# EAGLE design i2c-7segled-SOIC (EAGLE 7.3.0)
CNAME: aaa
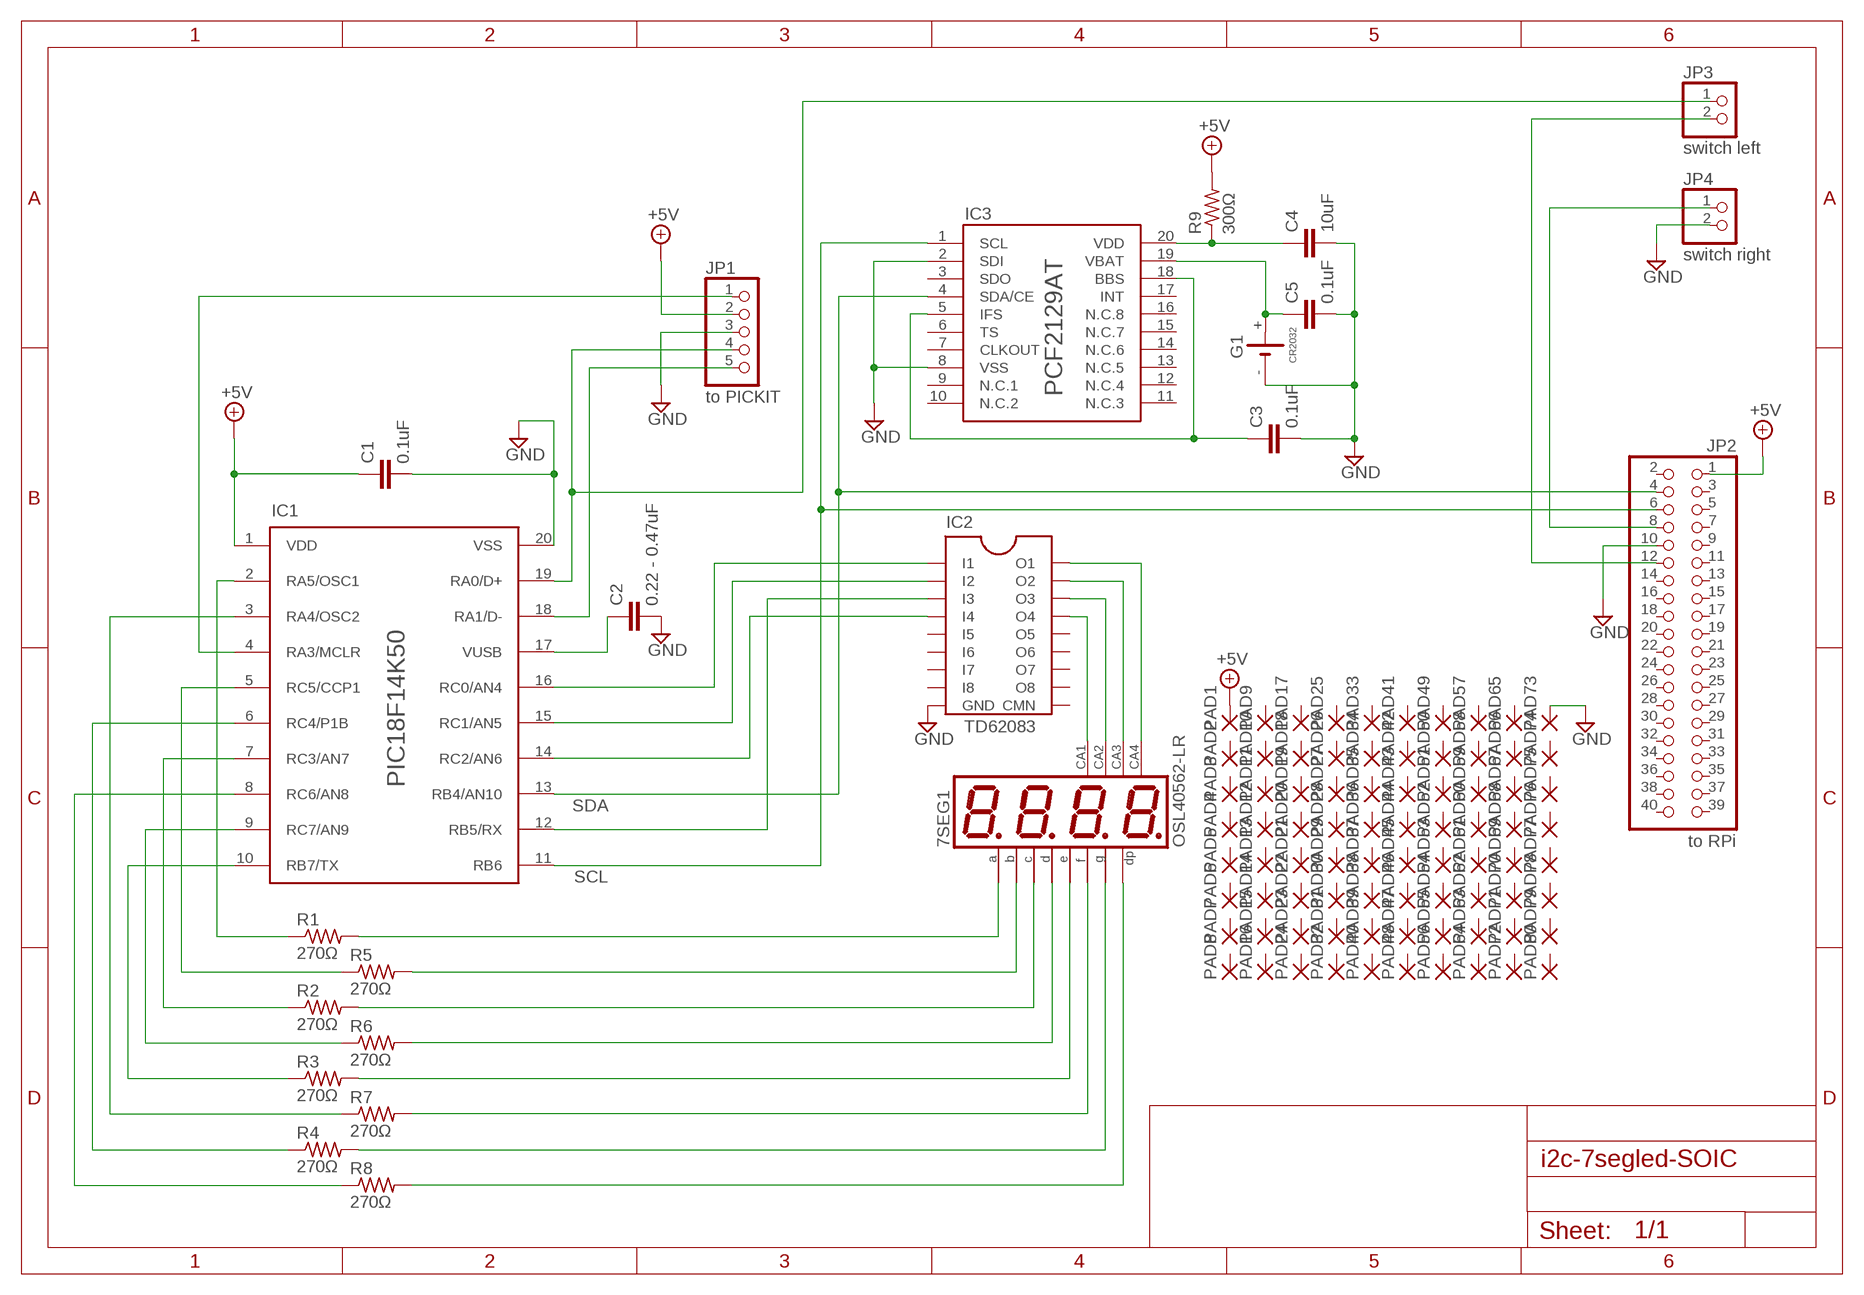
[diagram p0: schematic, sheet 1]

## Parts
7SEG1  OSL40562-LR  OSL40562-IR  [OSL40562]
C1  0.1uF  C-EUC0504  [C0504]
C2  0.22 - 0.47uF  C-EUC0504  [C0504]
C3  0.1uF  C-EUC0504  [C0504]
C4  10uF  C-EUC0504  [C0504]
C5  0.1uF  C-EUC0504  [C0504]
G1  CR2032  HU2032  [HU2032]
IC1  PIC18F14K50  PIC18F14K50-SO  [SO20]
IC2  TD62083  [SO18]
IC3  PCF2129AT  [SO20]
JP1  to PICKIT  PINHD-1X5  [1X05]
JP2  to RPi  PINHD-2X20  [2X20]
JP3  switch left  PINHD-1X2  [1X02]
JP4  switch right  PINHD-1X2  [1X02]
PAD1  1,6/0,9  [1,6/0,9]
PAD2  1,6/0,9  [1,6/0,9]
PAD3  1,6/0,9  [1,6/0,9]
PAD4  1,6/0,9  [1,6/0,9]
PAD5  1,6/0,9  [1,6/0,9]
PAD6  1,6/0,9  [1,6/0,9]
PAD7  1,6/0,9  [1,6/0,9]
PAD8  1,6/0,9  [1,6/0,9]
PAD9  1,6/0,9  [1,6/0,9]
PAD10  1,6/0,9  [1,6/0,9]
PAD11  1,6/0,9  [1,6/0,9]
PAD12  1,6/0,9  [1,6/0,9]
PAD13  1,6/0,9  [1,6/0,9]
PAD14  1,6/0,9  [1,6/0,9]
PAD15  1,6/0,9  [1,6/0,9]
PAD16  1,6/0,9  [1,6/0,9]
PAD17  1,6/0,9  [1,6/0,9]
PAD18  1,6/0,9  [1,6/0,9]
PAD19  1,6/0,9  [1,6/0,9]
PAD20  1,6/0,9  [1,6/0,9]
PAD21  1,6/0,9  [1,6/0,9]
PAD22  1,6/0,9  [1,6/0,9]
PAD23  1,6/0,9  [1,6/0,9]
PAD24  1,6/0,9  [1,6/0,9]
PAD25  1,6/0,9  [1,6/0,9]
PAD26  1,6/0,9  [1,6/0,9]
PAD27  1,6/0,9  [1,6/0,9]
PAD28  1,6/0,9  [1,6/0,9]
PAD29  1,6/0,9  [1,6/0,9]
PAD30  1,6/0,9  [1,6/0,9]
PAD31  1,6/0,9  [1,6/0,9]
PAD32  1,6/0,9  [1,6/0,9]
PAD33  1,6/0,9  [1,6/0,9]
PAD34  1,6/0,9  [1,6/0,9]
PAD35  1,6/0,9  [1,6/0,9]
PAD36  1,6/0,9  [1,6/0,9]
PAD37  1,6/0,9  [1,6/0,9]
PAD38  1,6/0,9  [1,6/0,9]
PAD39  1,6/0,9  [1,6/0,9]
PAD40  1,6/0,9  [1,6/0,9]
PAD41  1,6/0,9  [1,6/0,9]
PAD42  1,6/0,9  [1,6/0,9]
PAD43  1,6/0,9  [1,6/0,9]
PAD44  1,6/0,9  [1,6/0,9]
PAD45  1,6/0,9  [1,6/0,9]
PAD46  1,6/0,9  [1,6/0,9]
PAD47  1,6/0,9  [1,6/0,9]
PAD48  1,6/0,9  [1,6/0,9]
PAD49  1,6/0,9  [1,6/0,9]
PAD50  1,6/0,9  [1,6/0,9]
PAD51  1,6/0,9  [1,6/0,9]
PAD52  1,6/0,9  [1,6/0,9]
PAD53  1,6/0,9  [1,6/0,9]
PAD54  1,6/0,9  [1,6/0,9]
PAD55  1,6/0,9  [1,6/0,9]
PAD56  1,6/0,9  [1,6/0,9]
PAD57  1,6/0,9  [1,6/0,9]
PAD58  1,6/0,9  [1,6/0,9]
PAD59  1,6/0,9  [1,6/0,9]
PAD60  1,6/0,9  [1,6/0,9]
PAD61  1,6/0,9  [1,6/0,9]
PAD62  1,6/0,9  [1,6/0,9]
PAD63  1,6/0,9  [1,6/0,9]
PAD64  1,6/0,9  [1,6/0,9]
PAD65  1,6/0,9  [1,6/0,9]
PAD66  1,6/0,9  [1,6/0,9]
PAD67  1,6/0,9  [1,6/0,9]
PAD68  1,6/0,9  [1,6/0,9]
PAD69  1,6/0,9  [1,6/0,9]
PAD70  1,6/0,9  [1,6/0,9]
PAD71  1,6/0,9  [1,6/0,9]
PAD72  1,6/0,9  [1,6/0,9]
PAD73  1,6/0,9  [1,6/0,9]
PAD74  1,6/0,9  [1,6/0,9]
PAD75  1,6/0,9  [1,6/0,9]
PAD76  1,6/0,9  [1,6/0,9]
PAD77  1,6/0,9  [1,6/0,9]
PAD78  1,6/0,9  [1,6/0,9]
PAD79  1,6/0,9  [1,6/0,9]
PAD80  1,6/0,9  [1,6/0,9]
R1  270Ω  R-US_M0805  [M0805]
R2  270Ω  R-US_M0805  [M0805]
R3  270Ω  R-US_M0805  [M0805]
R4  270Ω  R-US_M0805  [M0805]
R5  270Ω  R-US_M0805  [M0805]
R6  270Ω  R-US_M0805  [M0805]
R7  270Ω  R-US_M0805  [M0805]
R8  270Ω  R-US_M0805  [M0805]
R9  300Ω  R-US_M0805  [M0805]

## Nets
+5V [power]: C1.1 IC1.1(VDD) JP1.2 JP2.1 PAD1.1(P) R9.2
GND [power]: C1.2 C2.2 C3.2 C4.2 C5.2 G1.- IC1.20(VSS) IC2.9(GND) IC3.2(SDI) IC3.8(VSS) JP1.3 JP2.10 JP4.2 PAD73.1(P)
N$1: 7SEG1.6(CA) IC2.18(O1)
N$2: C3.1 IC3.5(IFS) IC3.18(BBS)
N$3: C2.1 IC1.17(VUSB)
N$4: IC1.12(RB5/RX) IC2.3(I3)
N$5: JP2.12 JP3.2
N$7: IC1.14(RC2/AN6) IC2.4(I4)
N$8: IC1.15(RC1/AN5) IC2.2(I2)
N$9: IC1.16(RC0/AN4) IC2.1(I1)
N$10 [power]: C5.1 G1.+ IC3.19(VBAT)
N$11: 7SEG1.9(CA) IC2.16(O3)
N$12: 7SEG1.8(CA) IC2.17(O2)
N$13: 7SEG1.12(CA) IC2.15(O4)
N$14: IC1.2(RA5/OSC1) R1.1
N$15: 7SEG1.11(A) R1.2
N$16: IC1.5(RC5/CCP1) R5.1
N$17: IC1.7(RC3/AN7) R2.1
N$18: IC1.9(RC7/AN9) R6.1
N$19: IC1.10(RB7/TX) R3.1
N$20: IC1.3(RA4/OSC2) R7.1
N$21: IC1.6(RC4/P1B) R4.1
N$22: IC1.8(RC6/AN8) R8.1
N$23: 7SEG1.7(B) R5.2
N$24: 7SEG1.4(C) R2.2
N$25: 7SEG1.2(D) R6.2
N$26: 7SEG1.1(E) R3.2
N$27: 7SEG1.10(F) R7.2
N$28: 7SEG1.5(G) R4.2
N$29: 7SEG1.3(DP) R8.2
N$30: IC1.4(RA3/MCLR) JP1.1
N$31: IC1.19(RA0/D+) JP1.4 JP3.1
N$32: IC1.18(RA1/D-) JP1.5
N$35: IC1.11(RB6) IC3.1(SCL) JP2.6
N$36: JP2.8 JP4.1
N$39 [power]: C4.1 IC3.20(VDD) R9.1
SCL: IC1.13(RB4/AN10) IC3.4(SDA/CE) JP2.4
Unconnected: G1.+@2(+) IC2.5(I5) IC2.6(I6) IC2.7(I7) IC2.8(I8) IC2.10(CMN) IC2.11(O8) IC2.12(O7) IC2.13(O6) IC2.14(O5) IC3.3(SDO) IC3.6(TS) IC3.7(CLKOUT) IC3.9(N.C.1) IC3.10(N.C.2) IC3.11(N.C.3) IC3.12(N.C.4) IC3.13(N.C.5) IC3.14(N.C.6) IC3.15(N.C.7) IC3.16(N.C.8) IC3.17(INT) JP2.2 JP2.3 JP2.5 JP2.7 JP2.9 JP2.11 JP2.13 JP2.14 JP2.15 JP2.16 JP2.17 JP2.18 JP2.19 JP2.20 JP2.21 JP2.22 JP2.23 JP2.24 JP2.25 JP2.26 JP2.27 JP2.28 JP2.29 JP2.30 JP2.31 JP2.32 JP2.33 JP2.34 JP2.35 JP2.36 JP2.37 JP2.38 JP2.39 JP2.40 PAD2.1(P) PAD3.1(P) PAD4.1(P) PAD5.1(P) PAD6.1(P) PAD7.1(P) PAD8.1(P) PAD9.1(P) PAD10.1(P) PAD11.1(P) PAD12.1(P) PAD13.1(P) PAD14.1(P) PAD15.1(P) PAD16.1(P) PAD17.1(P) PAD18.1(P) PAD19.1(P) PAD20.1(P) PAD21.1(P) PAD22.1(P) PAD23.1(P) PAD24.1(P) PAD25.1(P) PAD26.1(P) PAD27.1(P) PAD28.1(P) PAD29.1(P) PAD30.1(P) PAD31.1(P) PAD32.1(P) PAD33.1(P) PAD34.1(P) PAD35.1(P) PAD36.1(P) PAD37.1(P) PAD38.1(P) PAD39.1(P) PAD40.1(P) PAD41.1(P) PAD42.1(P) PAD43.1(P) PAD44.1(P) PAD45.1(P) PAD46.1(P) PAD47.1(P) PAD48.1(P) PAD49.1(P) PAD50.1(P) PAD51.1(P) PAD52.1(P) PAD53.1(P) PAD54.1(P) PAD55.1(P) PAD56.1(P) PAD57.1(P) PAD58.1(P) PAD59.1(P) PAD60.1(P) PAD61.1(P) PAD62.1(P) PAD63.1(P) PAD64.1(P) PAD65.1(P) PAD66.1(P) PAD67.1(P) PAD68.1(P) PAD69.1(P) PAD70.1(P) PAD71.1(P) PAD72.1(P) PAD74.1(P) PAD75.1(P) PAD76.1(P) PAD77.1(P) PAD78.1(P) PAD79.1(P) PAD80.1(P)

## Notes on the sheet
- SDA

## Library data of the parts
7SEG1 = display-kingbright_2:OSL40562-?*: 14.22mm (0.56INCH) FOUR DIGIT NUMERIC DISPLAY OSL40562-xx(http://www.optosupply.com/UploadFile/PDF/osl40562-xx.pdf); COLOR: Red; MCD: 20mcd; MN: 630mn; VF: 2.1V
C1-C5 = rcl:C-EU: CAPACITOR, European symbol
G1 = takachi-battery-holder:HU2032: TAKACHI - Battery Holder - HU2032
IC1 = pic18f14k50:PIC18F14K50-SO: 20-Lead Plastic Shrink Small Outline (SO) - Wide, 7.50mm Body [SOIC] Source: http://ww1.microchip.com/downloads/en/DeviceDoc/40001350F.pdf Souce: http://ww1.microchip.com/downloads/jp/DeviceDoc/41350D_JP.pdf (Japanese)
IC2 = toshiba-td62083:TD62083: 8ch Darlington Sink Driver Source: http://akizukidenshi.com/download/TD62083AP.pdf
IC3 = nxp_pcf212X:PCF2129AT: Accurate RTC with integrated quartz crystal for industrial applications
JP1 = pinhead:PINHD-1X5: PIN HEADER
JP2 = pinhead:PINHD-2X20: PIN HEADER
JP3 JP4 = pinhead:PINHD-1X2: PIN HEADER
PAD1-PAD80 = testpad:1,6/0,9: THROUGH-HOLE PAD
R1-R9 = rcl:R-US_: RESISTOR, American symbol

## Net classes
0 default: width 0.254 mm, drill 0.305 mm, clearance 0.254 mm
1 analog: width 0.406 mm, drill 0.305 mm, clearance 0.406 mm
2 power: width 0.61 mm, drill 0.305 mm, clearance 0.254 mm

## Board
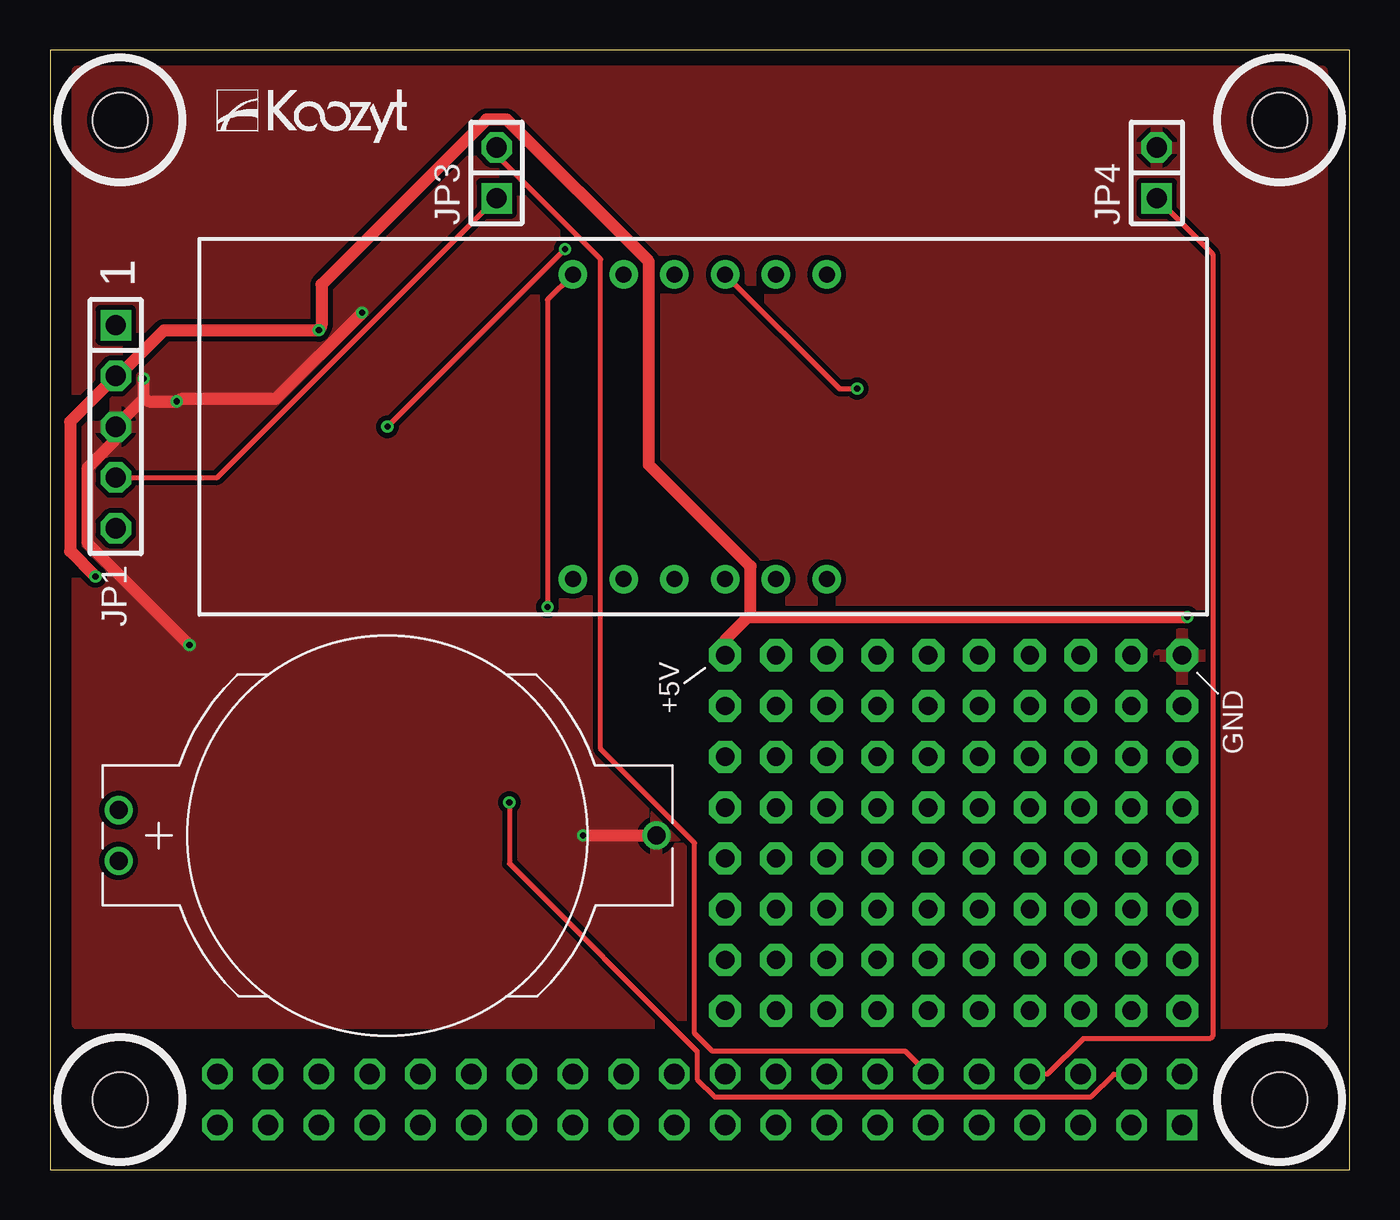
[diagram p1: board, top side]
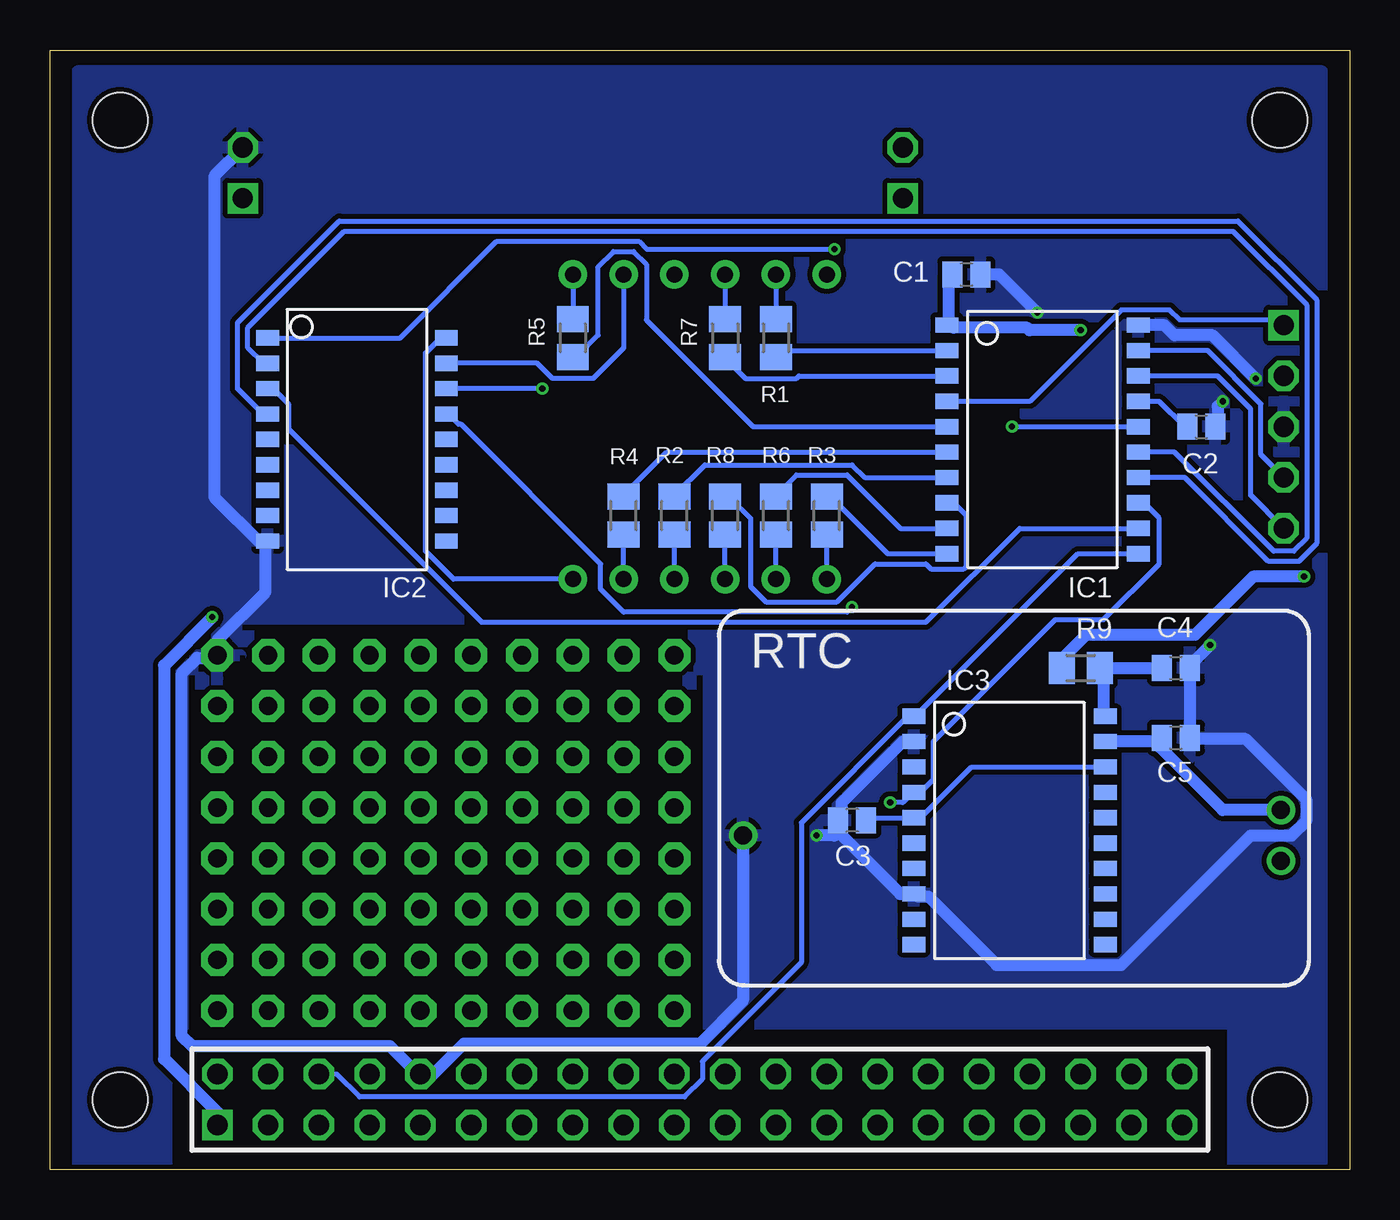
[diagram p2: board, bottom side, seen from below]

Size 65 x 56 mm. Coordinates in mm from the lower left corner, seen from the top.
Outline: 0,56 0,0 65,0 65,56 0,56
Copper layers (1*16): Top 0.035mm / dielectric 1.5mm / Bottom 0.035mm
Design rules "Elecrow_2-layer_eagle_rule": minimum track width 6mil, minimum drill 12mil, track to track 6mil, track to pad 6mil, pad to pad 6mil, via to via 6mil, smd to smd 0mil, copper to edge 10mil, drill to drill 10mil, minimum pad ring 10mil, minimum via ring 6mil, stop-mask expansion 2mil, vias tented up to drill 100mil, thermal gap 10mil
Holes 2.75 mm at 61.5,3.5 61.5,52.5 3.5,52.5 3.5,3.5
tRestrict: area 34.9,7.9 to 35.2,25.7; area 37.5,7.9 to 37.7,25.7; area 40,7.9 to 40.2,25.7; area 42.5,7.9 to 42.8,25.7; area 45.1,7.9 to 45.3,25.7; area 47.6,7.9 to 47.9,25.7; area 50.2,7.9 to 50.4,25.7; area 52.7,7.9 to 52.9,25.7; area 55.2,7.9 to 55.5,25.7; area 55.2,7.9 to 55.5,25.7; area 57.8,6.9 to 58,24.7; area 35,27 to 55.4,27.2; 2 more areas
bRestrict: area 55.2,7.9 to 55.5,25.7; area 52.7,7.9 to 52.9,25.7; area 50.2,7.9 to 50.4,25.7; area 47.6,7.9 to 47.9,25.7; area 45.1,7.9 to 45.3,25.7; area 42.5,7.9 to 42.8,25.7; area 40,7.9 to 40.2,25.7; area 37.5,7.9 to 37.7,25.7; area 34.9,7.9 to 35.2,25.7; area 57.8,6.9 to 58,24.7; area 32.4,6.9 to 32.6,24.7; area 35,27 to 55.4,27.2; 1 more areas

### Footprints (pad centres in the part's own frame; a part is rotated, then mirrored left to right if it is on the bottom)
OSL40562 = drill 0.8 pad 1.422: 1 -6.35,-7.62; 2 -3.81,-7.62; 3 -1.27,-7.62; 4 1.27,-7.62; 5 3.81,-7.62; 6 6.35,-7.62; 7 6.35,7.62; 8 3.81,7.62; 9 1.27,7.62; 10 -1.27,7.62; 11 -3.81,7.62; 12 -6.35,7.62
C0504 = smd 1 x 1.3: 1 -0.7,0; 2 0.7,0
HU2032 = drill 0.9: + -13.45,1.27; +@2 -13.45,-1.27; - 13.45,0
SO20 = smd 0.762 x 1.143: 1 -5.08,-4.788; 2 -3.81,-4.788; 3 -2.54,-4.788; 4 -1.27,-4.788; 5 0,-4.788; 6 1.27,-4.788; 7 2.54,-4.788; 8 3.81,-4.788; 9 5.08,-4.788; 10 6.35,-4.788; 11 6.35,4.788; 12 5.08,4.788; 13 3.81,4.788; 14 2.54,4.788; 15 1.27,4.788; 16 0,4.788; 17 -1.27,4.788; 18 -2.54,4.788; 19 -3.81,4.788; 20 -5.08,4.788
SO18 = smd 0.762 x 1.143: 1 -5.08,-3.835; 2 -3.81,-3.835; 3 -2.54,-3.835; 4 -1.27,-3.835; 5 0,-3.835; 6 1.27,-3.835; 7 2.54,-3.835; 8 3.81,-3.835; 9 5.08,-3.835; 10 5.08,5.105; 11 3.81,5.105; 12 2.54,5.105; 13 1.27,5.105; 14 0,5.105; 15 -1.27,5.105; 16 -2.54,5.105; 17 -3.81,5.105; 18 -5.08,5.105
1X05 = drill 1.016 square: 1 -5.08,0 | drill 1.016 octagon: 2 -2.54,0; 3 0,0; 4 2.54,0; 5 5.08,0
2X20 = drill 1.016 square: 1 -24.13,-1.27 | drill 1.016 octagon: 2 -24.13,1.27; 3 -21.59,-1.27; 4 -21.59,1.27; 5 -19.05,-1.27; 6 -19.05,1.27; 7 -16.51,-1.27; 8 -16.51,1.27; 9 -13.97,-1.27; 10 -13.97,1.27; 11 -11.43,-1.27; 12 -11.43,1.27; 13 -8.89,-1.27; 14 -8.89,1.27; 15 -6.35,-1.27; 16 -6.35,1.27; 17 -3.81,-1.27; 18 -3.81,1.27; 19 -1.27,-1.27; 20 -1.27,1.27; 21 1.27,-1.27; 22 1.27,1.27; 23 3.81,-1.27; 24 3.81,1.27; 25 6.35,-1.27; 26 6.35,1.27; 27 8.89,-1.27; 28 8.89,1.27; 29 11.43,-1.27; 30 11.43,1.27; 31 13.97,-1.27; 32 13.97,1.27; 33 16.51,-1.27; 34 16.51,1.27; 35 19.05,-1.27; 36 19.05,1.27; 37 21.59,-1.27; 38 21.59,1.27; 39 24.13,-1.27; 40 24.13,1.27
1X02 = drill 1.016 square: 1 -1.27,0 | drill 1.016 octagon: 2 1.27,0
1,6/0,9 = drill 0.914 pad 1.6 octagon: 1 0,0
M0805 = smd 1.3 x 1.6: 1 -0.95,0; 2 0.95,0

### Placement (x,y rotation side)
7SEG1  32.5,37.15 0 top
C1  19.16,44.77 0 bottom
C2  7.42,37.15 0 bottom
C3  24.88,17.47 180 bottom
C4  8.69,25.09 0 bottom
C5  8.69,21.6 0 bottom
G1  16.88,16.71 0 top
IC1  15.36,37.15 270 bottom
IC2  50.28,36.52 270 bottom
IC3  17.01,17.6 270 bottom
JP1  3.29,37.15 270 top
JP2  32.5,3.5 0 bottom
JP3  22.34,49.85 90 top
JP4  55.36,49.85 90 top
PAD1  33.77,25.73 90 top
PAD2  33.77,23.18 0 top
PAD3  33.77,20.64 0 top
PAD4  33.77,18.11 0 top
PAD5  33.77,15.57 0 top
PAD6  33.77,13.03 0 top
PAD7  33.77,10.49 0 top
PAD8  33.77,7.95 0 top
PAD9  36.31,25.73 90 top
PAD10  36.31,23.18 0 top
PAD11  36.31,20.64 0 top
PAD12  36.31,18.11 0 top
PAD13  36.31,15.57 0 top
PAD14  36.31,13.03 0 top
PAD15  36.31,10.49 0 top
PAD16  36.31,7.95 0 top
PAD17  38.85,25.73 90 top
PAD18  38.85,23.18 0 top
PAD19  38.85,20.64 0 top
PAD20  38.85,18.11 0 top
PAD21  38.85,15.57 0 top
PAD22  38.85,13.03 0 top
PAD23  38.85,10.49 0 top
PAD24  38.85,7.95 0 top
PAD25  41.39,25.73 90 top
PAD26  41.39,23.18 0 top
PAD27  41.39,20.64 0 top
PAD28  41.39,18.11 0 top
PAD29  41.39,15.57 0 top
PAD30  41.39,13.03 0 top
PAD31  41.39,10.49 0 top
PAD32  41.39,7.95 0 top
PAD33  43.93,25.73 90 top
PAD34  43.93,23.18 0 top
PAD35  43.93,20.64 0 top
PAD36  43.93,18.11 0 top
PAD37  43.93,15.57 0 top
PAD38  43.93,13.03 0 top
PAD39  43.93,10.49 0 top
PAD40  43.93,7.95 0 top
PAD41  46.47,25.73 90 top
PAD42  46.47,23.18 0 top
PAD43  46.47,20.64 0 top
PAD44  46.47,18.11 0 top
PAD45  46.47,15.57 0 top
PAD46  46.47,13.03 0 top
PAD47  46.47,10.49 0 top
PAD48  46.47,7.95 0 top
PAD49  49.01,25.73 90 top
PAD50  49.01,23.18 0 top
PAD51  49.01,20.64 0 top
PAD52  49.01,18.11 0 top
PAD53  49.01,15.57 0 top
PAD54  49.01,13.03 0 top
PAD55  49.01,10.49 0 top
PAD56  49.01,7.95 0 top
PAD57  51.55,25.73 90 top
PAD58  51.55,23.18 0 top
PAD59  51.55,20.64 0 top
PAD60  51.55,18.11 0 top
PAD61  51.55,15.57 0 top
PAD62  51.55,13.03 0 top
PAD63  51.55,10.49 0 top
PAD64  51.55,7.95 0 top
PAD65  54.09,25.73 90 top
PAD66  54.09,23.18 0 top
PAD67  54.09,20.64 0 top
PAD68  54.09,18.11 0 top
PAD69  54.09,15.57 0 top
PAD70  54.09,13.03 0 top
PAD71  54.09,10.49 0 top
PAD72  54.09,7.95 0 top
PAD73  56.63,25.73 0 top
PAD74  56.63,23.18 0 top
PAD75  56.63,20.64 0 top
PAD76  56.63,18.11 0 top
PAD77  56.63,15.57 0 top
PAD78  56.63,13.03 0 top
PAD79  56.63,10.49 0 top
PAD80  56.63,7.95 0 top
R1  28.69,41.6 90 bottom
R2  33.77,32.71 270 bottom
R3  26.15,32.71 270 bottom
R4  36.31,32.71 270 bottom
R5  38.85,41.6 90 bottom
R6  28.69,32.71 270 bottom
R7  31.23,41.6 90 bottom
R8  31.23,32.71 270 bottom
R9  13.45,25.09 180 bottom
U$2  [KOOZYT-LOGO-WAKU-10MM]  8.12,51.25 0 top

### Tracks (layer width: path | path; a pad name or v marks a point on that pad's centre or on a via)
+5V  (via drill 0.3)
  Top 0.61: v2.27,29.66 1,30.93 1,37.41 JP1.2 3.54,39.82 5.7,41.98 v13.45,41.98 13.58,42.23 13.58,44.27 21.83,52.52 22.85,52.52 29.96,45.41 29.96,35.25 35.04,30.17 35.04,27.63 | 35.04,27.63 34.91,27.63 33.77,26.49 PAD1.1 | 35.04,27.63 v56.88,27.63
  Bottom 0.61: C1.1 19.93,44.77 20.05,44.65 20.05,42.23 IC1.1 19.8,42.11 16.12,42.11 15.99,41.98 v13.45,41.98 | v2.27,29.66 4.81,29.66 7.74,26.74 13.2,26.74 14.34,25.6 14.34,25.09 R9.2 | JP2.1 56.63,2.87 59.3,5.53 59.3,25.22 v56.88,27.63
GND  (via drill 0.3)
  Top 0.61: 4.69,38.55 v4.69,39.57 | 4.69,38.55 JP1.3 3.16,36.9 3.16,36.39 1.89,35.12 1.89,31.31 v6.97,26.23 | 4.69,38.55 4.94,38.42 v6.34,38.42 6.59,38.55 11.29,38.55 v15.61,42.87 | v26.66,16.71 G1.-
  Bottom 0.61: JP4.2 56.76,49.73 56.76,33.6 54.47,31.31 IC2.9 54.22,31.44 54.22,28.9 56.63,26.49 PAD73.1 56.88,25.6 57.65,25.6 58.41,24.84 58.41,6.68 57.9,6.17 47.99,6.17 46.72,4.9 JP2.10 45.84,4.77 44.31,6.29 32.5,6.29 30.34,8.45 30.34,16.71 G1.- | IC1.20 9.26,42.23 8.75,41.73 6.85,41.73 v4.69,39.57 | v6.34,38.42 6.59,38.17 6.59,37.15 C2.2 | C1.2 17.51,44.77 v15.61,42.87 | 25.52,16.84 22.47,13.79 IC3.8 21.58,13.66 21.07,13.66 17.64,10.23 11.42,10.23 4.94,16.71 2.91,16.71 2.15,17.47 2.15,18.49 5.2,21.53 7.74,21.53 C5.2 7.99,21.66 C4.2 7.86,25.34 v6.97,26.23 | 25.52,16.84 25.52,17.47 C3.2 25.39,17.72 25.39,18.36 22.34,21.41 IC3.2 | v26.66,16.71 25.77,16.71 25.52,16.84
  pour Top: 1.39,54.93 63.62,54.93 63.62,7.31 1.39,7.31
  pour Bottom: 1.39,54.93 63.62,54.93 63.62,0.32 59.17,0.32 59.17,7.31 5.83,7.31 5.83,0.32 1.39,0.32
N$1
  Bottom 0.254: IC2.18 45.45,41.6 46.22,40.84 46.22,30.93 44.82,29.54 7SEG1.6
N$2
  Bottom 0.254: C3.1 24.12,17.47 23.99,17.6 IC3.5 21.45,17.6 18.91,20.14 IC3.18
N$3
  Bottom 0.254: IC1.17 9.51,38.42 8.24,37.15 C2.1
N$4
  Bottom 0.254: IC1.12 16.5,32.07 21.2,27.38 43.42,27.38 53.07,37.03 53.07,38.3 53.84,39.06 IC2.3
N$5
  Top 0.254: JP3.2 22.34,50.74 27.55,45.54 27.55,21.03 32.25,16.33 32.25,6.8 33.13,5.91 42.79,5.91 JP2.12
N$7
  Bottom 0.254: IC1.14 8.24,34.61 4.05,30.42 2.53,30.42 1.64,31.31 1.64,43.5 5.58,47.44 50.53,47.44 55.61,42.36 55.61,39.06 54.34,37.79 IC2.4
N$8
  Bottom 0.254: IC1.15 8.75,35.88 3.8,30.93 2.78,30.93 2.15,31.57 2.15,43.25 5.83,46.93 50.28,46.93 55.11,42.11 55.11,41.09 54.34,40.33 IC2.2
N$9  (via drill 0.3)
  Top 0.254: v25.77,46.04 v16.88,37.15
  Bottom 0.254: v16.88,37.15 IC1.16 | v25.77,46.04 35.17,46.04 35.55,46.43 42.66,46.43 47.49,41.6 IC2.1
N$10
  Bottom 0.61: IC3.19 9.64,21.41 9.51,21.53 C5.1 9.51,21.15 6.34,17.98 G1.+
N$11  (via drill 0.3)
  Top 0.254: v40.37,39.06 39.48,39.06 7SEG1.9
  Bottom 0.254: v40.37,39.06 IC2.16
N$12
  Bottom 0.254: IC2.17 40.63,40.33 39.87,39.57 37.83,39.57 36.31,41.09 7SEG1.8
N$13  (via drill 0.3)
  Top 0.254: v24.88,28.14 24.88,43.5 7SEG1.12
  Bottom 0.254: v24.88,28.14 25.13,27.88 36.31,27.88 37.45,29.03 37.45,30.3 44.44,37.28 44.56,37.28 45.07,37.79 IC2.15
N$14
  Bottom 0.254: IC1.2 28.44,40.96 28.69,40.71 R1.1
N$15
  Bottom 0.254: 7SEG1.11 R1.2
N$16
  Bottom 0.254: IC1.5 29.83,37.15 35.17,42.49 35.17,45.28 35.8,45.92 36.82,45.92 37.58,45.16 37.58,41.73 38.6,40.71 38.85,40.71 R5.1
N$17
  Bottom 0.254: IC1.7 24.25,34.61 24.88,35.25 32.25,35.25 33.77,33.73 R2.1
N$18
  Bottom 0.254: IC1.9 22.47,32.07 25.13,34.74 27.67,34.74 28.69,33.73 R6.1
N$19
  Bottom 0.254: IC1.10 23.1,30.8 25.9,33.6 26.15,33.6 R3.1
N$20
  Bottom 0.254: IC1.3 27.55,39.7 27.67,39.57 30.21,39.57 31.23,40.58 R7.1
N$21
  Bottom 0.254: IC1.6 34.15,35.88 36.31,33.73 R4.1
N$22
  Bottom 0.254: IC1.8 19.8,33.34 19.16,32.71 19.16,30.17 19.29,30.04 20.94,30.04 21.2,30.3 23.74,30.3 25.64,28.39 29.2,28.39 29.96,29.15 29.96,32.58 30.98,33.6 31.23,33.6 R8.1
N$23
  Bottom 0.254: 7SEG1.7 R5.2
N$24
  Bottom 0.254: 7SEG1.4 R2.2
N$25
  Bottom 0.254: 7SEG1.2 R6.2
N$26
  Bottom 0.254: 7SEG1.1 R3.2
N$27
  Bottom 0.254: 7SEG1.10 R7.2
N$28
  Bottom 0.254: 7SEG1.5 R4.2
N$29
  Bottom 0.254: 7SEG1.3 R8.2
N$30
  Bottom 0.254: IC1.4 15.99,38.42 11.42,43 9.01,43 8.5,42.49 3.54,42.49 JP1.1
N$31
  Top 0.254: JP3.1 8.37,34.61 JP1.4
  Bottom 0.254: IC1.19 7.1,40.96 4.43,38.3 4.43,35.76 JP1.4
N$32
  Bottom 0.254: IC1.18 6.59,39.7 4.94,38.04 4.94,33.73 JP1.5
N$35
  Bottom 0.254: IC1.11 13.58,30.8 21.7,22.68 IC3.1 22.09,22.68 27.42,17.34 27.42,10.36 32.37,5.4 32.37,4.52 33.26,3.63 49.52,3.63 50.66,4.77 JP2.6
N$36
  Top 0.254: JP2.8 49.9,4.77 51.68,6.55 58.03,6.55 58.15,6.68 58.15,45.79 JP4.1
N$39
  Bottom 0.61: IC3.20 12.31,22.68 12.31,24.96 12.43,25.09 R9.1 C4.1
SCL  (via drill 0.3)
  Top 0.254: JP2.4 53.2,4.77 52.06,3.63 33.26,3.63 32.37,4.52 32.37,5.91 22.98,15.31 v22.98,18.36
  Bottom 0.254: IC1.13 10.28,33.34 9.51,32.58 9.51,30.3 12.31,27.5 14.72,27.5 20.82,21.41 20.82,19.5 21.45,18.87 IC3.4 21.83,18.87 22.34,18.36 v22.98,18.36

### Text on the board
tPlace: 1 | +5V | GND
bPlace: RTC